# EAGLE design Sterownik_DC (EAGLE 6.6.0)
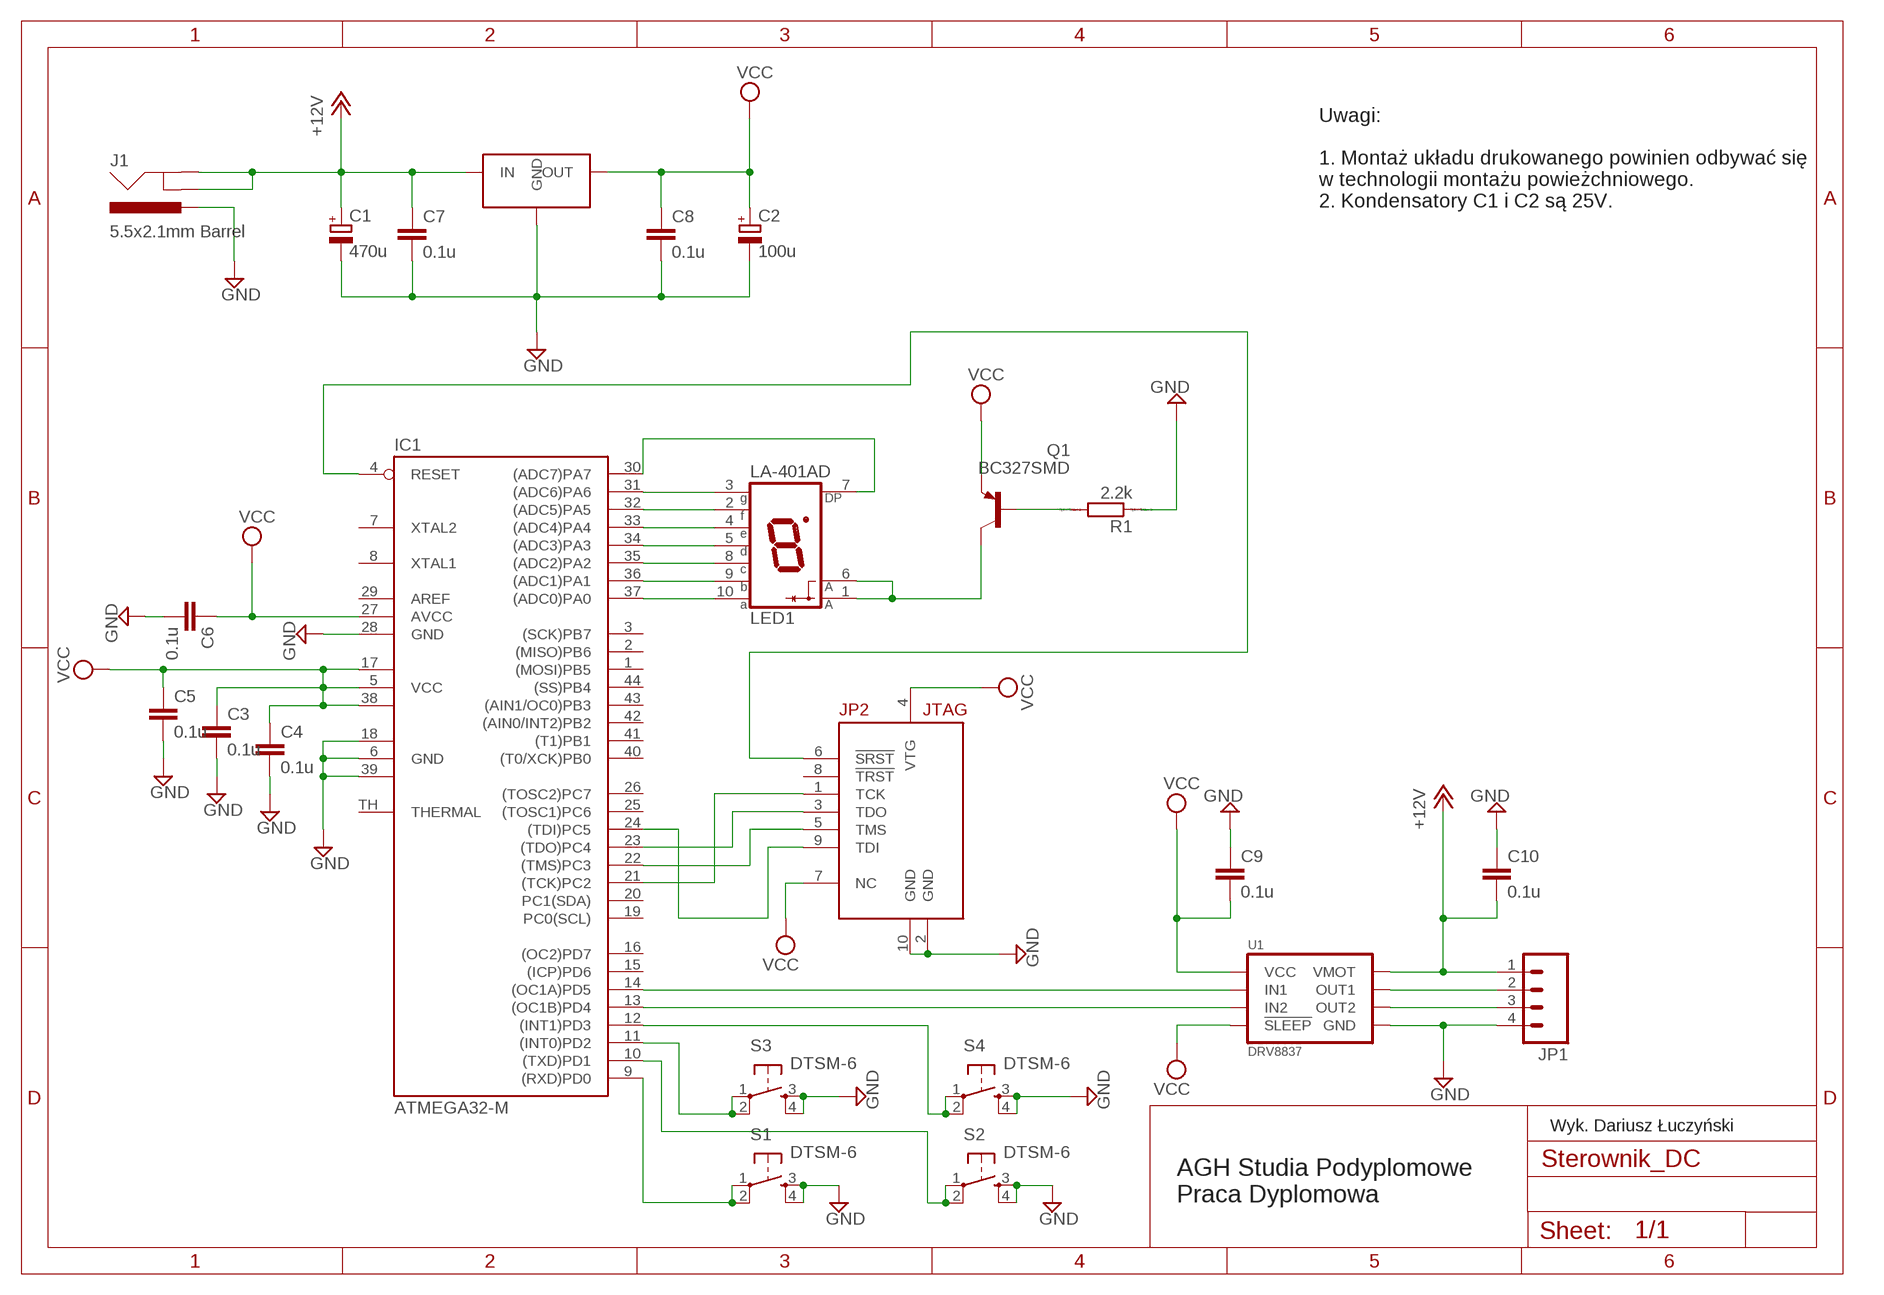
[diagram p0: schematic, sheet 1]

## Parts
C1  470u  CPOL-EU175TMP-0810  [175TMP-0810]
C2  100u  CPOL-EU175TMP-0810  [175TMP-0810]
C3  0.1u  C-EUC2012  [C2012]
C4  0.1u  C-EUC2012  [C2012]
C5  0.1u  C-EUC2012  [C2012]
C6  0.1u  C-EUC2012  [C2012]
C7  0.1u  C-EUC2012  [C2012]
C8  0.1u  C-EUC2012  [C2012]
C9  0.1u  C-EUC2012  [C2012]
C10  0.1u  C-EUC2012  [C2012]
IC1  ATMEGA32-M  [MLF44-TH]
J1  5.5x2.1mm Barrel  POWER_JACKSMD  [POWER_JACK_SMD]
JP1  M04SMD_STRAIGHT_COMBO  [1X04_SMD_STRAIGHT_COMBO]
JP2  JTAGICE3-CONNECTOR50MIL-SMD  [JTAGIC3-50MIL-SMD]
LED1  LA-401AD  [LA-401]
Q1  BC327SMD  [SOT23-BEC]
R1  2.2k  RR2012  [R2012]
S1  DTSM-6  [DTSM-6]
S2  DTSM-6  [DTSM-6]
S3  DTSM-6  [DTSM-6]
S4  DTSM-6  [DTSM-6]
U1  DRV8837  [DSG]
U$1  VREG-7805-DPAK2  [VREG-7805-DPAK2]

## Nets
+12V: C1.+ C7.1 C10.2 J1.GND(GNDBREAK) J1.P$4(GND) JP1.1 U1.1(VMOT) U$1.VIN(IN)
GND: C1.- C2.- C3.2 C4.2 C5.2 C6.2 C7.2 C8.2 C9.1 C10.1 IC1.6(GND) IC1.18(GND1) IC1.28(GND) IC1.39(GND2) J1.VIN0(PWR) JP1.4 JP2.2(GND) JP2.10(GND) R1.1 S1.3 S1.4 S2.3 S2.4 S3.3 S3.4 S4.3 S4.4 U1.4(GND) U1.PAD(GND) U$1.GND
N$1: JP1.2 U1.2(OUT1)
N$2: IC1.4(RESET) JP2.6(!SRST)
N$3: IC1.35((ADC2)PA2) LED1.8(C)
N$4: Q1.B R1.2
N$5: IC1.11((INT0)PD2) S3.1 S3.2
N$6: IC1.21((TCK)PC2) JP2.1(TCK)
N$7: IC1.23((TDO)PC4) JP2.3(TDO)
N$8: IC1.31((ADC6)PA6) LED1.3(G)
N$9: IC1.32((ADC5)PA5) LED1.2(F)
N$10: IC1.33((ADC4)PA4) LED1.4(E)
N$11: IC1.34((ADC3)PA3) LED1.5(D)
N$12: IC1.37((ADC0)PA0) LED1.10(A)
N$13: IC1.36((ADC1)PA1) LED1.9(B)
N$15: IC1.30((ADC7)PA7) LED1.7(DP)
N$16: LED1.1(A) LED1.6(A) Q1.C
N$17: IC1.10((TXD)PD1) S2.1 S2.2
N$18: IC1.22((TMS)PC3) JP2.5(TMS)
N$19: IC1.13((OC1B)PD4) U1.5(IN2)
N$20: IC1.12((INT1)PD3) S4.1 S4.2
N$21: IC1.14((OC1A)PD5) U1.6(IN1)
N$22: IC1.9((RXD)PD0) S1.1 S1.2
N$23: JP1.3 U1.3(OUT2)
N$24: IC1.24((TDI)PC5) JP2.9(TDI)
VCC: C2.+ C3.1 C4.1 C5.1 C6.1 C8.1 C9.2 IC1.5(VCC) IC1.17(VCC1) IC1.27(AVCC) IC1.38(VCC2) JP2.4(VTG) JP2.7(NC) Q1.E U1.7(!SLEEP) U1.8(VCC) U$1.VOUT(OUT)
Unconnected: IC1.1((MOSI)PB5) IC1.2((MISO)PB6) IC1.3((SCK)PB7) IC1.7(XTAL2) IC1.8(XTAL1) IC1.15((ICP)PD6) IC1.16((OC2)PD7) IC1.19(PC0(SCL)) IC1.20(PC1(SDA)) IC1.25((TOSC1)PC6) IC1.26((TOSC2)PC7) IC1.29(AREF) IC1.40((T0/XCK)PB0) IC1.41((T1)PB1) IC1.42((AIN0/INT2)PB2) IC1.43((AIN1/OC0)PB3) IC1.44((SS)PB4) IC1.TH(THERMAL) JP2.8(!TRST)

## Notes on the sheet
- Uwagi:
  
  1. Montaż układu drukowanego powinien odbywać się
  w technologii montażu powieżchniowego.
  2. Kondensatory C1 i C2 są 25V.
- Wyk. Dariusz Łuczyński
- AGH Studia Podyplomowe
  Praca Dyplomowa

## Library data of the parts
C1 C2 = rcl:CPOL-EU: POLARIZED CAPACITOR, European symbol
C3-C10 = rcl:C-EU: CAPACITOR, European symbol
IC1 = atmega-atxmega:ATMEGA32-M: MICROCONTROLLER 32 Kbytes FLASH 2 Kbytes SRAM 1 Kbytes EEPROM USART 8-channel 10 bit ADC Source: www.atmel.com .. doc2503.pdf; MPN: ATMEGA32-16MU; OC_FARNELL: 1455108; OC_NEWARK: 58M3733
J1 = SparkFun-Connectors:POWER_JACK: Power Jack This is the standard 5.5mm barrel jack for power. The PTH is the most common, proven, reliable, footprint. The Slot footprint only works if the mill layer is transmitted to the PCB fab house so be warned. Spark Fun Electronics SKU : PRT-00119 SMT: CONN-08106 Mating wall wart : TOL-00298 (and others); PROD_ID: CONN-08106
JP1 = SparkFun-Connectors:M04: Header 4 Standard 4-pin 0.1" header. Use with straight break away headers (SKU : PRT-00116), right angle break away headers (PRT-00553), swiss pins (PRT-00743), machine pins (PRT-00117), and female headers (PRT-00115). Molex polarized connector foot print use with SKU : PRT-08231 with associated crimp pins and housings. 1MM SMD Version SKU: PRT-10208
JP2 = con-jtagice3:JTAGICE3-CONNECTOR: JTAG Connector for JTAGICE3 Designed by Michael Hohl <http://www.michaelhohl.net/> in May 2013. You are free to use, edit and distribute this library.
LED1 = led-7-segment:LA-401*D: Single Digit LED Numeric Display (anode common) Source: ROHM .. la-1401dn.pdf; OC_FARNELL: unknown; OC_NEWARK: unknown
Q1 = transistor-pnp:BC327*: PNP Transistror
R1 = eagle-ltspice:R: RESISTOR, European symbol; SPICEMODEL: NONE; SPICEPREFIX: R
S1-S4 = switch-tact:DTSM-6
U1 = packages(ti):DRV8837
U$1 = vreg-7805-dpak2:VREG-7805-DPAK2

## Board
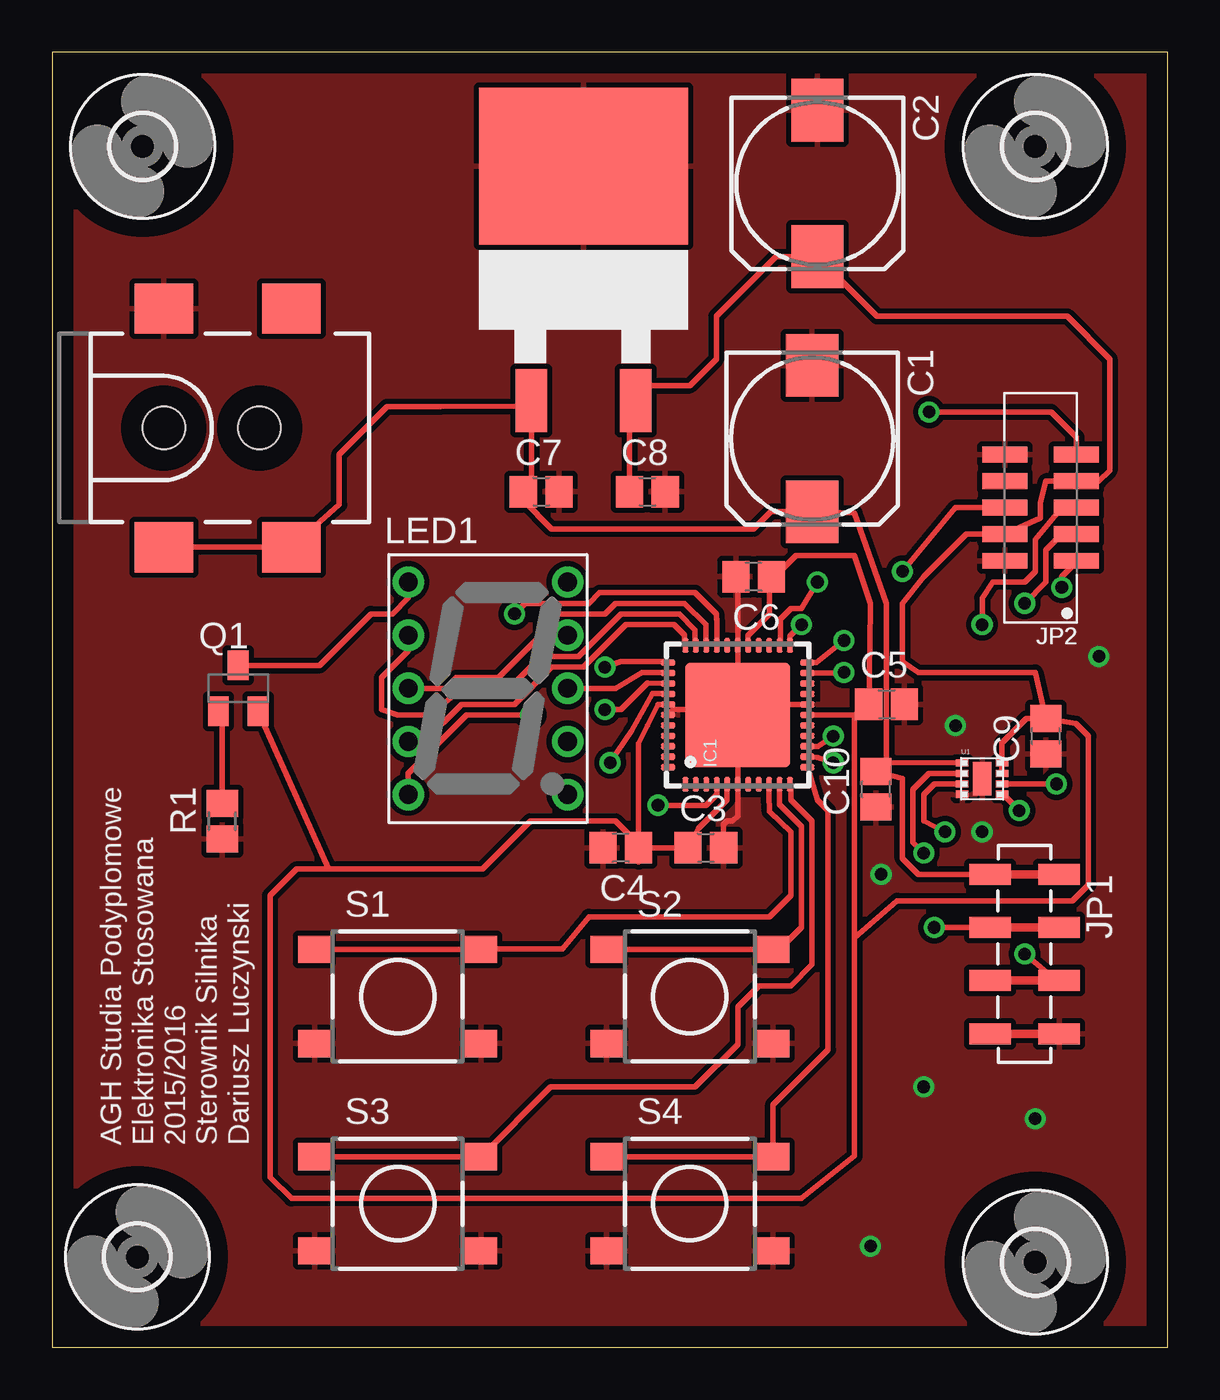
[diagram p1: board, top side]
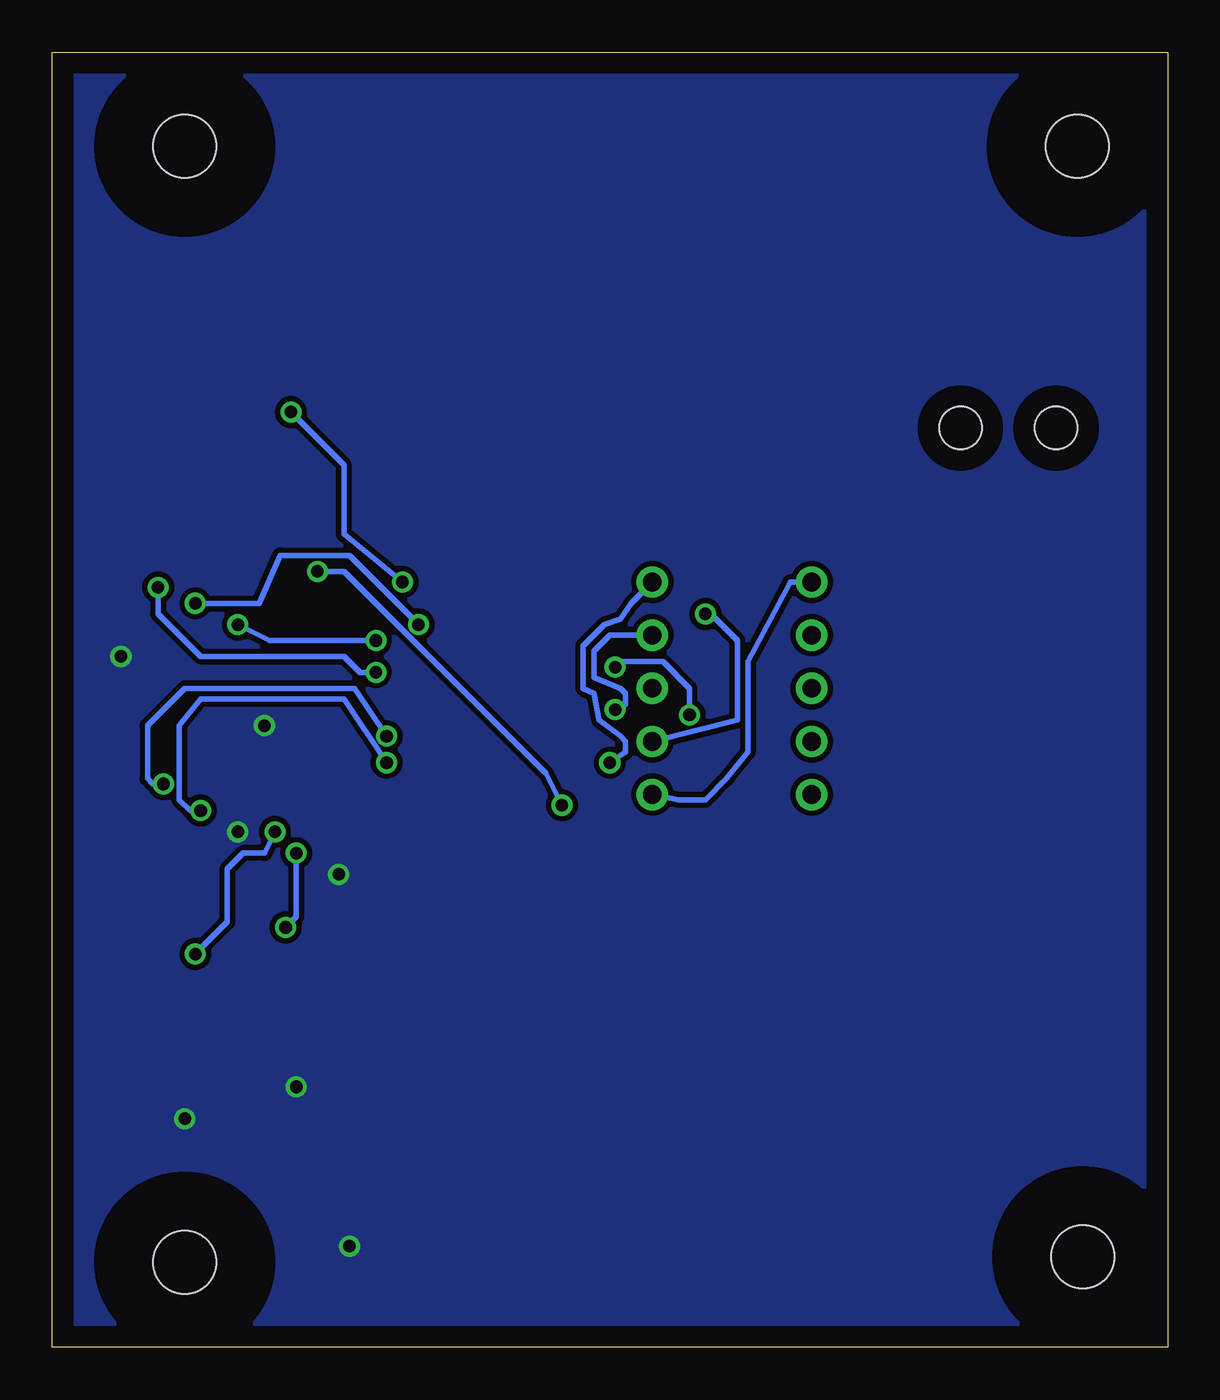
[diagram p2: board, bottom side, seen from below]

Size 53.32 x 61.9 mm. Coordinates in mm from the lower left corner, seen from the top.
Outline: 0,0 53.32,0 53.32,61.9 0,61.9 0,0
Copper layers (1*16): Top 0.035mm / dielectric 1.5mm / Bottom 0.035mm
Design rules "default": minimum track width 10mil, minimum drill 24mil, track to track 8mil, track to pad 8mil, pad to pad 8mil, via to via 8mil, smd to smd 8mil, copper to edge 40mil, drill to drill 8mil, minimum pad ring 10mil, minimum via ring 8mil, stop-mask expansion 4mil, vias tented up to drill 0mil, thermal gap 10mil

### Footprints (pad centres in the part's own frame; a part is rotated, then mirrored left to right if it is on the bottom)
175TMP-0810 = smd 3 x 2.5: + 3.5,0; - -3.5,0
C2012 = smd 1.3 x 1.5: 1 -0.85,0; 2 0.85,0
MLF44-TH = smd 0.7 x 0.3: 1 -3.325,2.5; 2 -3.325,2; 3 -3.325,1.5; 4 -3.325,1; 5 -3.325,0.5; 6 -3.325,0; 7 -3.325,-0.5; 8 -3.325,-1; 9 -3.325,-1.5; 10 -3.325,-2; 11 -3.325,-2.5; 23 3.325,-2.5; 24 3.325,-2; 25 3.325,-1.5; 26 3.325,-1; 27 3.325,-0.5; 28 3.325,0; 29 3.325,0.5; 30 3.325,1; 31 3.325,1.5; 32 3.325,2; 33 3.325,2.5 | smd 0.3 x 0.7: 12 -2.5,-3.325; 13 -2,-3.325; 14 -1.5,-3.325; 15 -1,-3.325; 16 -0.5,-3.325; 17 0,-3.325; 18 0.5,-3.325; 19 1,-3.325; 20 1.5,-3.325; 21 2,-3.325; 22 2.5,-3.325; 34 2.5,3.325; 35 2,3.325; 36 1.5,3.325; 37 1,3.325; 38 0.5,3.325; 39 0,3.325; 40 -0.5,3.325; 41 -1,3.325; 42 -1.5,3.325; 43 -2,3.325; 44 -2.5,3.325 | smd 5 x 5: TH 0,0
POWER_JACK_SMD = smd 2.8 x 2.4: GND 0,-5.7; P$4 6.1,-5.7; VIN0 0,5.7; VIN1 6.1,5.7 | hole 2.032: 0,0; 4.572,0
1X04_SMD_STRAIGHT_COMBO = smd 1 x 2: 1 0,-1.65; 1-2 0,1.65; 2 2.54,1.65; 2-2 2.54,-1.65; 3 5.08,-1.65; 3-2 5.08,1.65; 4 7.62,1.65; 4-2 7.62,-1.65
JTAGIC3-50MIL-SMD = smd 0.762 x 2.159: 1 -2.54,-1.714; 2 -2.54,1.714; 3 -1.27,-1.714; 4 -1.27,1.714; 5 0,-1.714; 6 0,1.714; 7 1.27,-1.714; 8 1.27,1.714; 9 2.54,-1.714; 10 2.54,1.714
LA-401 = drill 0.9 pad 1.5: 1 -3.81,5.08; 2 -3.81,2.54; 3 -3.81,0; 4 -3.81,-2.54; 5 -3.81,-5.08; 6 3.81,-5.08; 7 3.81,-2.54; 8 3.81,0; 9 3.81,2.54; 10 3.81,5.08
SOT23-BEC = smd 1 x 1.4: B -0.95,-1.1; C 0,1.1; E 0.95,-1.1
R2012 = smd 1.3 x 1.5: 1 -0.85,0; 2 0.85,0
DTSM-6 = smd 1.55 x 1.3: 1 -3.975,2.25; 2 3.975,2.25; 3 -3.975,-2.25; 4 3.975,-2.25
DSG = smd 0.6 x 0.35: 1 -0.95,0.75; 2 -0.95,0.25; 3 -0.95,-0.25; 4 -0.95,-0.75; 5 0.95,-0.75; 6 0.95,-0.25; 7 0.95,0.25; 8 0.95,0.75 | smd 0.9 x 1.6: PAD 0,0
VREG-7805-DPAK2 = smd 10 x 7.5: GND 0,8.7 | smd 1.5 x 3: VIN -2.5,-2.5; VOUT 2.5,-2.5
3,0 = hole 3: 0,0

### Placement (x,y rotation side)
C1  36.32,43.43 270 top
C2  36.58,55.63 270 top
C3  31.24,23.88 0 top
C4  27.18,23.88 180 top
C5  39.88,30.73 0 top
C6  33.53,36.83 180 top
C7  23.37,40.89 0 top
C8  28.45,40.89 0 top
C9  47.5,29.21 90 top
C10  39.37,26.67 90 top
IC1  32.77,30.23 90 top
J1  5.33,43.94 0 top
JP1  46.48,22.61 270 top
JP2  47.24,40.13 90 top
LED1  20.83,31.5 0 top
Q1  8.89,31.5 0 top
R1  8.13,25.15 90 top
S1  16.51,16.76 0 top
S2  30.48,16.76 0 top
S3  16.51,6.86 0 top
S4  30.48,6.86 0 top
U1  44.45,27.18 0 top
U$1  25.4,47.75 0 top
U$2  [3,0]  46.99,57.4 0 top
U$3  [3,0]  46.99,4.06 0 top
U$4  [3,0]  4.06,4.32 0 top
U$5  [3,0]  4.32,57.4 0 top
U$6  [A4L-LOC]  -87.12,-46.23 0 top  (outside the outline)

### Tracks (layer width: path | path; a pad name or v marks a point on that pad's centre or on a via)
+12V
  Top 0.254: U$1.VIN 22.86,45.25 | U$1.VIN 22.94,45.21 | J1.GND J1.P$4 13.72,40.27 13.72,42.67 16,44.96 18.54,44.96 22.9,45 | 22.9,45 U$1.VIN | 22.9,45 22.9,41.28 C7.1 22.52,40.47 23.88,39.12 33.53,39.12 34.35,39.93 C1.+ 38.35,39.88 39.88,35.56 39.88,27.77 | 39.88,27.77 C10.2 40.64,27.18 40.64,23.37 41.4,22.61 JP1.1 | 43.49,27.94 U1.1 39.62,27.94 39.88,27.77
GND  (via drill 0.6)
  Top 0.254: IC1.39 29.7,30.48 31.75,30.48 | 31.75,30.48 32.77,31.5 | 32.77,31.5 IC1.28 32.77,36.74 C6.2 | IC1.18 34.29,30.73 33.53,31.5 32.77,31.5 | 31.75,30.48 31.75,30.23 32.51,29.46 32.51,29.21 32.77,28.96 IC1.6 32.77,25.4 32.51,25.15 32.26,25.15 32.09,24.98 C3.2
  other vias: 44.45,24.64 43.18,29.72 50.04,33.02 39.62,22.61 41.66,12.45 46.99,10.92 39.12,4.83
  pour Top (isolate 0.254): 0,66.04 0,0 55.88,0 55.88,66.04
  pour Bottom (isolate 0.254): 0,66.04 0,0 55.88,0 55.88,66.04
N$1  (via drill 0.6)
  Top 0.254: U1.2 41.91,27.43 41.15,26.67 41.15,24.13 v41.66,23.62 | v42.16,20.07 JP1.2
  Bottom 0.254: v41.66,23.62 41.66,20.57 v42.16,20.07
N$2  (via drill 0.6)
  Top 0.254: JP2.6 43.18,40.13 v40.64,37.08 | v28.96,25.91 31.24,25.91 31.77,26.43 IC1.4
  Bottom 0.254: v40.64,37.08 39.37,37.08 29.72,27.43 v28.96,25.91
N$3
  Top 0.254: IC1.35 29.41,32.26 28.19,32.26 26.92,31.5 LED1.8
N$4
  Top 0.254: R1.2 8.13,30.21 Q1.B
N$5
  Top 0.254: S3.1 S3.2 23.82,12.45 30.73,12.45 32.77,14.48 32.77,16.26 33.78,17.27 35.31,17.27 36.32,18.29 36.32,25.15 35.31,26.16 35.31,26.86 IC1.11
N$6  (via drill 0.6)
  Top 0.254: JP2.1 48.96,37.53 48.26,36.83 v48.26,36.32 | v37.85,32.26 37.81,32.23 IC1.21
  Bottom 0.254: v48.26,36.32 48.26,35.05 46.23,33.02 39.37,33.02 38.61,32.26 v37.85,32.26
N$7  (via drill 0.6)
  Top 0.254: JP2.3 48.26,38.86 47.5,38.1 47.5,36.58 v46.48,35.56 | v35.81,34.54 35.27,34 IC1.23
  Bottom 0.254: v46.48,35.56 43.43,35.56 42.42,37.85 39.12,37.85 v35.81,34.54
N$8
  Top 0.254: LED1.3 18.8,31.5 19.3,32 21.34,32 23.37,34.04 23.37,34.54 23.88,35.05 26.42,35.05 26.92,35.56 30.23,35.56 31.24,34.54 31.24,33.58 IC1.31
N$9
  Top 0.254: LED1.2 17.02,33.27 15.75,32 15.75,30.48 16.51,30.23 18.03,30.23 19.3,31.24 21.59,31.24 23.37,33.02 25.15,33.02 27.18,35.05 29.97,35.05 30.73,34.29 30.73,33.58 IC1.32
N$10
  Top 0.254: LED1.4 17.78,28.96 19.56,30.73 22.1,30.73 23.88,32.51 25.4,32.51 27.43,34.54 29.72,34.54 30.23,34.04 30.23,33.59 IC1.33
N$11  (via drill 0.6 pad 0.25)
  Top 0.254: LED1.5 17.02,27.43 19.81,30.23 v22.86,30.23 | v26.42,32.51 27.18,32.77 29.4,32.77 IC1.34
  Bottom 0.254: v22.86,30.23 22.86,31.5 24.13,32.77 26.16,32.77 v26.42,32.51
N$12  (via drill 0.6)
  Top 0.254: IC1.37 29.43,31.24 28.7,31.24 27.69,29.46 v26.67,27.94
  Bottom 0.254: LED1.10 25.65,35.56 26.16,34.8 26.92,34.54 27.94,33.53 27.94,31.5 27.43,31.24 27.18,29.97 26.16,29.21 25.91,28.96 25.91,28.45 v26.67,27.94
N$13  (via drill 0.6 pad 0.25)
  Top 0.254: 29.42,31.75 IC1.36 28.45,31.75 27.18,30.48 v26.42,30.48
  Bottom 0.254: LED1.9 26.67,34.04 27.43,33.27 27.43,32 26.16,31.5 25.91,31.24 25.91,30.73 v26.42,30.48
N$15  (via drill 0.6 pad 0.25)
  Top 0.254: IC1.30 31.77,34.78 31.75,34.8 31.75,35.05 30.73,36.07 27.69,36.07 27.18,36.07 26.16,36.07 25.65,35.56 22.61,35.56 v22.1,35.05
  Bottom 0.254: LED1.7 20.57,29.97 20.57,33.78 21.84,35.05 v22.1,35.05
N$16
  Top 0.254: Q1.C 12.78,32.6 15.24,35.05 16.26,35.05 17.02,35.81 LED1.1
  Bottom 0.254: LED1.1 18.03,36.58 20.07,32.77 20.07,28.45 21.08,27.18 22.1,26.16 23.37,26.16 LED1.6
N$17
  Top 0.254: S2.1 S2.2 34.76,19.01 35.81,20.07 35.81,24.89 34.77,25.94 IC1.10
N$18  (via drill 0.6)
  Top 0.254: v37.85,33.78 36.54,32.73 IC1.22 | JP2.5 48.26,40.13 46.99,38.61 46.99,37.08 46.48,36.58 44.96,36.58 44.45,35.81 v44.45,34.54
  Bottom 0.254: v44.45,34.54 42.93,33.78 v37.85,33.78
N$19  (via drill 0.6)
  Top 0.254: IC1.13 36.58,28.19 v37.34,27.94 | v46.23,25.65 45.45,26.43 U1.5
  Bottom 0.254: v37.34,27.94 39.37,30.99 46.23,30.99 47.24,29.72 47.24,26.16 46.74,25.65 v46.23,25.65
N$20
  Top 0.254: S4.1 S4.2 34.45,11.6 37.08,14.22 37.08,25.65 36.58,26.16 36.13,27.69 IC1.12
N$21  (via drill 0.6)
  Top 0.254: IC1.14 36.6,28.73 v37.34,29.21 | v48.01,26.92 v48,26.93 U1.6
  Bottom 0.254: v37.34,29.21 38.86,31.5 46.99,31.5 48.77,29.72 48.77,27.18 48.51,26.92 v48.01,26.92
N$22
  Top 0.254: S1.1 S1.2 20.52,19.05 24.38,19.05 25.65,20.57 34.29,20.57 35.31,21.59 35.31,24.64 34.29,25.61 34.27,26.39 IC1.9 34.29,26.88
N$23  (via drill 0.6)
  Top 0.254: U1.3 42.16,26.92 41.66,26.42 41.66,25.15 v42.67,24.64 | v46.48,18.8 48.01,17.53 JP1.3
  Bottom 0.254: v42.67,24.64 43.18,23.62 44.2,23.62 44.96,22.86 44.96,20.32 v46.48,18.8
N$24  (via drill 0.6)
  Top 0.254: IC1.24 34.8,33.58 34.8,34.8 35.31,35.31 35.81,35.31 v36.58,36.58 | JP2.9 48.96,43.5 47.75,44.7 v41.91,44.7
  Bottom 0.254: v36.58,36.58 39.37,38.86 39.37,42.16 v41.91,44.7
VCC
  Top 0.254: IC1.27 33.27,34.03 34.29,35.05 34.29,36.74 C6.1 34.38,36.66 35.56,37.85 38.35,37.85 39.12,35.56 39.12,35.31 C5.1 39.03,30.65 38.35,30.23 | IC1.38 28.96,30.73 28.45,29.72 28.03,28.87 28.03,24.38 | IC1.5 32.26,26.89 32.26,26.16 30.9,24.8 C3.1 C4.1 | U1.7 U1.8 45.4,28.89 46.57,30.06 C9.2 | C9.2 48.93,29.81 49.53,29.21 49.53,22.1 48.77,21.34 40.39,21.34 38.35,19.56 | 38.35,30.23 38.35,19.56 | 38.35,19.56 38.35,9.14 35.81,7.11 11.43,7.11 10.41,8.13 10.41,21.59 11.68,22.86 13.21,22.86 | 13.21,22.86 20.57,22.86 22.86,25.15 26.92,25.15 27.69,24.38 28.03,24.38 | 28.03,24.38 C4.1 | 28.03,23.2 C4.1 | IC1.17 38.35,30.23 | Q1.E 13.21,22.86 | C9.2 46.99,32.26 41.4,32.26 40.64,32.77 40.64,35.56 41.66,36.83 43.69,38.86 JP2.4 47.24,39.62 47.24,40.39 47.5,41.4 JP2.7 50.04,41.4 50.55,41.91 50.55,47.24 48.51,49.28 39.43,49.28 C2.+ 34.6,52.13 31.75,49.28 31.75,47.24 30.48,45.97 28.62,45.97 U$1.VOUT 27.6,44.95 C8.1

### Text on the board
tNames: AGH Studia Podyplomowe / Elektronika Stosowana / 2015/2016 | Sterownik Silnika / Dariusz Luczynski
_tPlace: JP2 | JP2 | JP2
Descript: Wyk. Dariusz Łuczyński | AGH Studia Podyplomowe / Praca Dyplomowa